# Altium schematic sheet Relay.SchDoc
size A3
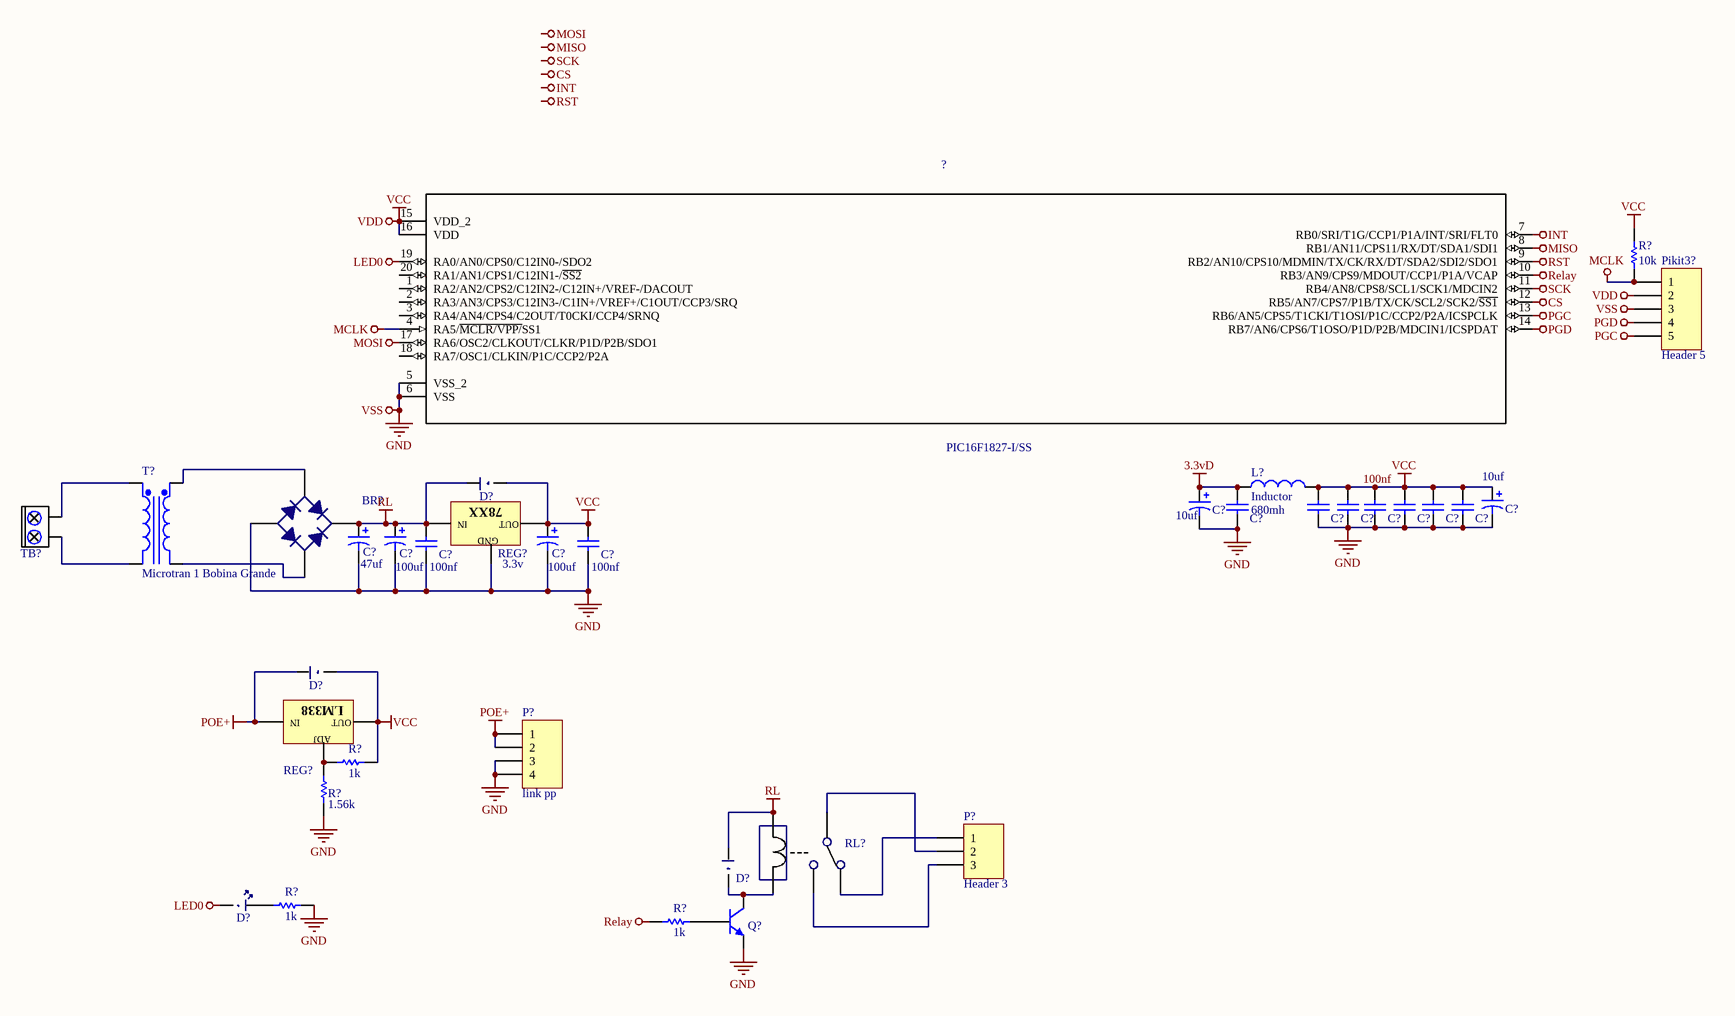
[diagram p0: Relay.SchDoc]

## Parts
(Parts that share a designator on the sheet are numbered #1, #2 ... from top to bottom, then left to right.)
?  PIC16F1827-I/SS  [SOP65P780X200-20N]
BR?  Puente Diodo Rectificador  [Bridge Rectifier 1]  (value not drawn)
C?#1  10uf  [Electrolytic Capacitor S]
C?#2  Capacitor de paso  [Capacitor de paso 1]  (value not drawn)
C?#3  Capacitor de paso  [Capacitor de paso 1]  (value not drawn)
C?#4  Capacitor de paso  [Capacitor de paso 1]  (value not drawn)
C?#5  Capacitor de paso  [Capacitor de paso 1]  (value not drawn)
C?#6  Capacitor de paso  [Capacitor de paso 1]  (value not drawn)
C?#7  Capacitor de paso  [Capacitor de paso 1]  (value not drawn)
C?#8  Capacitor de paso  [Capacitor de paso 1]  (value not drawn)
C?#9  10uf  [Electrolytic Capacitor S]
C?#10  47uf  [Electrolytic Capacitor S]
C?#11  100uf  [Electrolytic Capacitor S]
C?#12  100nf  [Capacitor de paso 1]
C?#13  100uf  [Electrolytic Capacitor S]
C?#14  100nf  [Capacitor de paso 1]
D?#1  Diodo  [1n400X]  (value not drawn)
D?#2  Diodo  [1n400X]  (value not drawn)
D?#3  Diodo  [1n400X]  (value not drawn)
D?#4  LED  [LED]  (value not drawn)
L?  Inductor  value 680mh  [0402-A]
P?#1  link pp  [HDR1X4]
P?#2  Header 3  [HDR1X3]
Pikit3?  Header 5  [HDR1X5]
Q?  Transistor NPN  [TO-92 3]  (value not drawn)
R?#1  10k  [Resistor 1/4 W]
R?#2  1k  [Resistor 1/4 W]
R?#3  1.56k  [Resistor 1/4 W]
R?#4  1k  [Resistor 1/4 W]
R?#5  1k  [Resistor 1/4 W]
REG?#1  3.3v  [TO-220]
REG?#2  LM338  [TO-220 + Heatsink]  (value not drawn)
RL?  Relay SPDT  [SPDT Relay]  (value not drawn)
T?  Microtran 1 Bobina Grande  [MICROTRAN ALEX]
TB?  Terminal Block 2  [Terminal Block 2P]  (value not drawn)

## Nets
3.3vD: C?#1.1 C?#2.2 L?.1
100nf: ?.15(VDD_2) ?.16(VDD) C?#3.2 C?#4.2 C?#5.2 C?#6.2 C?#7.2 C?#8.2 C?#9.1 C?#13.1 C?#14.2 D?#1.1 D?#2.1 L?.2 Pikit3?.2 R?#1.1 R?#2.1 REG?#1.3 REG?#2.2  [also labelled VCC, VDD]
CS: ?.12(RB5/AN7/CPS7/P1B/TX/CK/SCL2/SCK2/~{SS1})
GND: ?.5(VSS_2) ?.6(VSS) BR?.3(A) C?#1.2 C?#2.1 C?#3.1 C?#4.1 C?#5.1 C?#6.1 C?#7.1 C?#8.1 C?#9.2 C?#10.2 C?#11.2 C?#12.1 C?#13.2 C?#14.1 P?#1.3 P?#1.4 Pikit3?.3 Q?.1(E) R?#3.1 R?#4.1 REG?#1.2  [also labelled VSS]
INT: ?.7(RB0/SRI/T1G/CCP1/P1A/INT/SRI/FLT0)
LED0: ?.19(RA0/AN0/CPS0/C12IN0-/SDO2) D?#4.1
MCLK: ?.4(RA5/~{MCLR/VPP/}SS1) Pikit3?.1 R?#1.2
MISO: ?.8(RB1/AN11/CPS11/RX/DT/SDA1/SDI1)
MOSI: ?.17(RA6/OSC2/CLKOUT/CLKR/P1D/P2B/SDO1)
PGC: ?.13(RB6/AN5/CPS5/T1CKI/T1OSI/P1C/CCP2/P2A/ICSPCLK) Pikit3?.5
PGD: ?.14(RB7/AN6/CPS6/T1OSO/P1D/P2B/MDCIN1/ICSPDAT) Pikit3?.4
POE+: D?#2.2 P?#1.1 P?#1.2 REG?#2.3
Relay: ?.10(RB3/AN9/CPS9/MDOUT/CCP1/P1A/VCAP) R?#5.2
RL: BR?.1(K) C?#10.1 C?#11.1 C?#12.2 D?#1.2 D?#3.2 REG?#1.1 RL?.1
RST: ?.9(RB2/AN10/CPS10/MDMIN/TX/CK/RX/DT/SDA2/SDI2/SDO1)
SCK: ?.11(RB4/AN8/CPS8/SCL1/SCK1/MDCIN2)
NetD?#3_1: D?#3.1 Q?.3(C) RL?.2
NetD?#4_2: D?#4.2 R?#4.2
NetP?#2_1: P?#2.1 RL?.5
NetP?#2_2: P?#2.2 RL?.3
NetP?#2_3: P?#2.3 RL?.4
NetQ?_2: Q?.2(B) R?#5.1
NetR?#2_2: R?#2.2 R?#3.2 REG?#2.1
NetT?_1: T?.1(Pri+) TB?.1
NetT?_2: T?.2(Pri-) TB?.2

Not connected (* = marked no-connect by the designer): ? 1(RA2/AN2/CPS2/C12IN2-/C12IN+/VREF-/DACOUT) 2(RA3/AN3/CPS3/C12IN3-/C1IN+/VREF+/C1OUT/CCP3/SRQ) 3(RA4/AN4/CPS4/C2OUT/T0CKI/CCP4/SRNQ) 18(RA7/OSC1/CLKIN/P1C/CCP2/P2A) 20(RA1/AN1/CPS1/C12IN1-/~{SS2}); BR? 2(C) 4(C); T? 3(Sec+) 4(Sec-)

## Notes on the sheet
- Labels drawn without touching a wire or pin: CS, INT, MISO, MOSI, RST, SCK
- (in symbol LM338) IN; OUT; ADJ
- (in symbol Regulador 78XX) 78XX; IN; OUT; GND

## Library data of the parts
? = PIC16F1827-I/SS: PIC12 Series 384 B RAM 7 kB Flash 80 MHz 8-Bit Microcontroller SMT - SSOP-20; MF: Microchip; MP: PIC16F1827-I/SS; Digi-Key_Purchase_URL: https://www.digikey.do/product-detail/en/microchip-technology/PIC16F1827-I-SS/PIC16F1827-I-SS-ND/2201967?utm_source=snapeda&utm_medium=aggregator&utm_campaign=symbol; Package: SSOP-20 Microchip; SnapEDA_Link: https://www.snapeda.com/parts/PIC16F1827-I/SS/Microchip/view-part/?ref=snap; Digi-Key_Part_Number: PIC16F1827-I/SS-ND; Value: *
C?#1 C?#9-C?#11 C?#13 = Capacitor Electrolitico
C?#12 C?#14 = Capacitor de paso
L? = Inductor: Code_IEC: 1005; Published: 8-Jun-2000; LatestRevisionDate: 29-May-2009; LatestRevisionNote: IPC-7351 Footprint Added.; PackageReference: 0402-A; Publisher: Altium Limited; PackageDescription: Chip Inductor; Code_JEITA: 0402
P?#1 = Header 4: Header, 4-Pin; LatestRevisionDate: 17-Jul-2002; LatestRevisionNote: Re-released for DXP Platform.; Publisher: Altium Limited
P?#2 = Header 3: Header, 3-Pin; LatestRevisionDate: 17-Jul-2002; LatestRevisionNote: Re-released for DXP Platform.; Publisher: Altium Limited
Pikit3? = Header 5: Header, 5-Pin; LatestRevisionDate: 17-Jul-2002; LatestRevisionNote: Re-released for DXP Platform.; Publisher: Altium Limited
R?#1-R?#5 = Resistor
REG?#1 = Regulador 78XX: Voltage Regulator
REG?#2 = LM338: Variable Voltage Regulator
T? = Microtran 1 Bobina Grande: Amarillo; Published: 8-Jun-2000; LatestRevisionDate: 17-Jul-2002; LatestRevisionNote: Re-released for DXP Platform.; PackageReference: TRF_5; Publisher: Altium Limited; PackageDescription: Transformer; 5 Leads